# Altium schematic sheet OCSPI.SchDoc: OCSPI
size A4; CompanyName: STMicroelectronics; Organization: Microcontrollers Division; DocumentNumber: 8; SheetNumber: 9; SheetTotal: 19
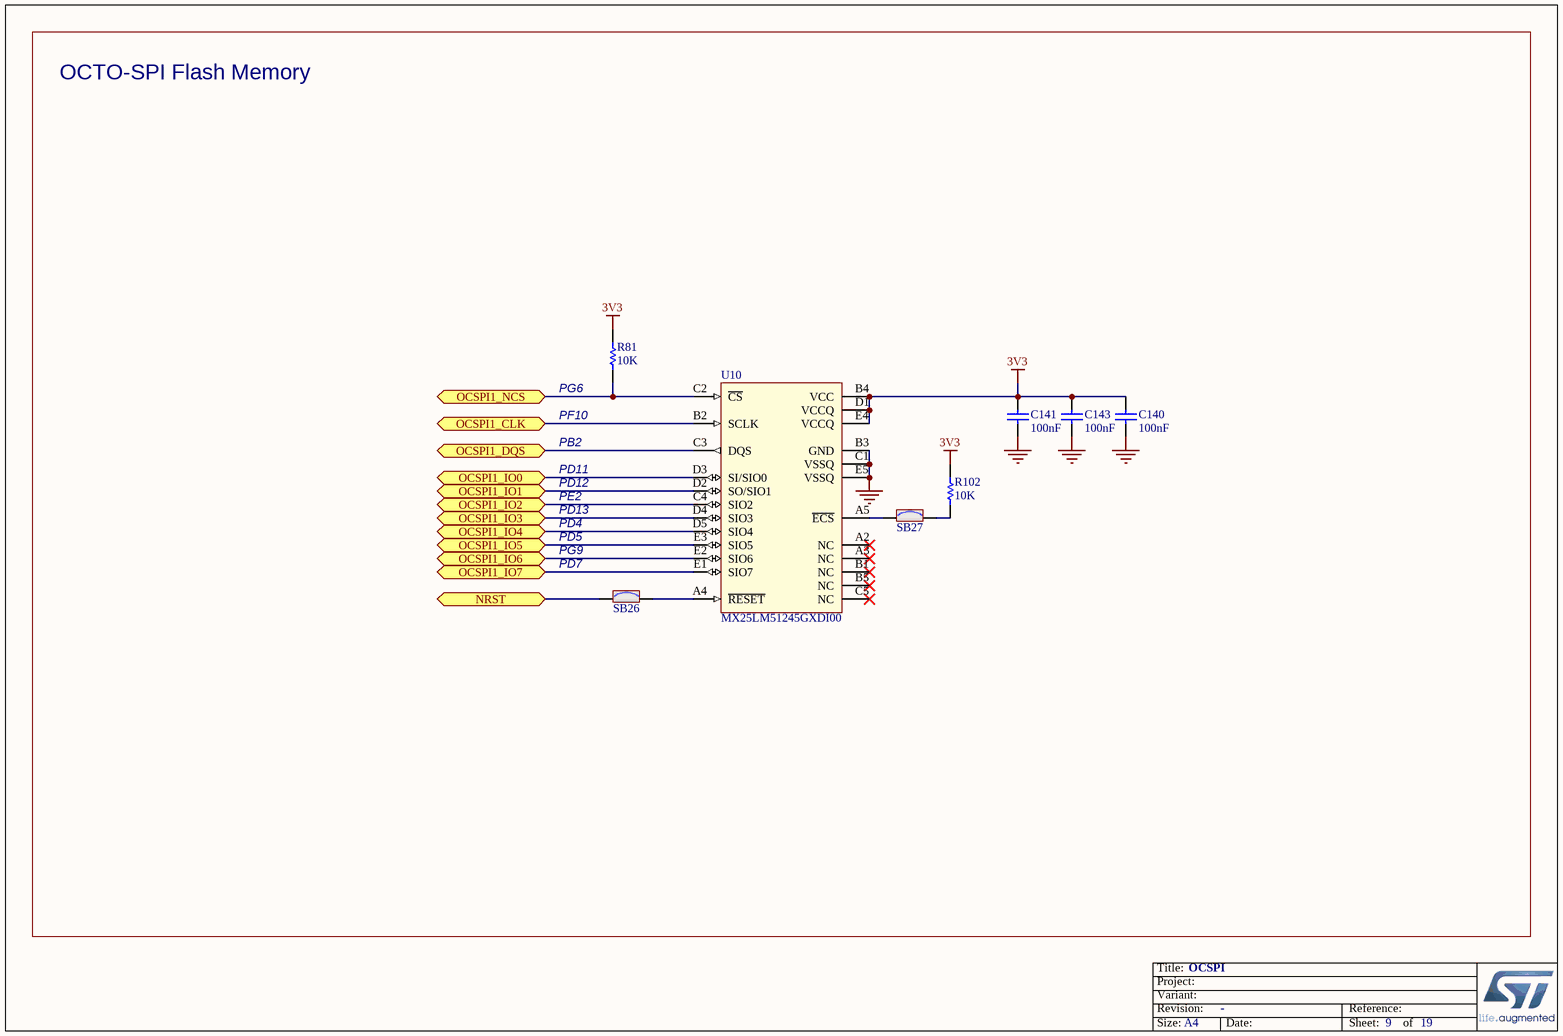
[diagram p0: OCSPI.SchDoc]

## Parts
C140  value 100nF  [C0402]  (hidden comment: Capacitor)
C141  value 100nF  [C0402]  (hidden comment: Capacitor)
C143  value 100nF  [C0402]  (hidden comment: Capacitor)
R81  value 10K  [R0402]  (hidden comment: Resistor)
R102  value 10K  [R0402]  (hidden comment: Resistor)
SB26  SB_ON  [SOLDER-BRIDGE_R0603-0R]  (value not drawn)
SB27  SB_ON  [SOLDER-BRIDGE_R0603-0R]  (value not drawn)
U10  MX25LM51245GXDI00  [ICC_BGA24_5X5-BALL-ARRAY_6X8_P1]

## Ports
NRST, OCSPI1_CLK (bidir), OCSPI1_DQS (bidir), OCSPI1_IO0 (bidir), OCSPI1_IO1 (bidir), OCSPI1_IO2 (bidir), OCSPI1_IO3 (bidir), OCSPI1_IO4 (bidir), OCSPI1_IO5 (bidir), OCSPI1_IO6 (bidir), OCSPI1_IO7 (bidir), OCSPI1_NCS (bidir)

## Nets
3V3: C140.2 C141.2 C143.2 R81.2 R102.2 U10.B4(VCC) U10.D1(VCCQ) U10.E4(VCCQ)
GND: C140.1 C141.1 C143.1 U10.B3(GND) U10.C1(VSSQ) U10.E5(VSSQ)
NRST: SB26.1 ; port NRST
OCSPI1_CLK: U10.B2(SCLK) ; port OCSPI1_CLK
OCSPI1_DQS: U10.C3(DQS) ; port OCSPI1_DQS
OCSPI1_IO0: U10.D3(SI/SIO0) ; port OCSPI1_IO0
OCSPI1_IO1: U10.D2(SO/SIO1) ; port OCSPI1_IO1
OCSPI1_IO2: U10.C4(SIO2) ; port OCSPI1_IO2
OCSPI1_IO3: U10.D4(SIO3) ; port OCSPI1_IO3
OCSPI1_IO4: U10.D5(SIO4) ; port OCSPI1_IO4
OCSPI1_IO5: U10.E3(SIO5) ; port OCSPI1_IO5
OCSPI1_IO6: U10.E2(SIO6) ; port OCSPI1_IO6
OCSPI1_IO7: U10.E1(SIO7) ; port OCSPI1_IO7
OCSPI1_NCS: R81.1 U10.C2(~{CS}) ; port OCSPI1_NCS
NetR102_1: R102.1 SB27.2
NetSB26_2: SB26.2 U10.A4(~{RESET})
NetSB27_1: SB27.1 U10.A5(~{ECS})

Not connected (* = marked no-connect by the designer): U10 A2(NC)* A3(NC)* B1(NC)* B5(NC)* C5(NC)*

## Notes on the sheet
- OCTO-SPI Flash Memory
- (near R81) PG6
- (near R81) PF10
- PB2
- PD11
- PD12
- PE2
- PD13
- PD4
- PD5
- PG9
- (near SB26) PD7
- Title:
- Project:
- Size:
- Revision:
- Variant:
- A4
- -
- Date:
- Reference:
- Sheet:
- of

## Library data of the parts
C140 C141 C143 = MCD-00102: Capacitor, MLCC, 100nF, 16V, X7R, 10%, 0402, T=0,5mm; Manufacturer_Part_Number: CC0402KRX7R7BB104; Manufacturer: YAGEO; Alternate_Manufacturer_Part_Number: GCM155R71C104KA55D; Alternate_Manufacturer: MURATA; ECCN_US: EAR99; ECCN_EU: NEC; Provided_By: SUBCO; Internal_Part_Number: MCD-00102; Status: Released; Part_Type: Capacitor; Package: C0402; ComponentLink1Description: Datasheet; ComponentLink1URL: http://tunmcdsvn.tun.st.com/Component_Datasheet_Library/Trunk/Capacitors/Yageo_Multilayer_Capacitor_X7R_series_100pF_to_22uF
R81 R102 = MCD-00053: Resistor,10K,0402,1%,1/16W; Manufacturer_Part_Number: RC0402FR-0710KL; Manufacturer: YAGEO; ECCN_US: EAR99; ECCN_EU: NEC; Provided_By: SUBCO; Internal_Part_Number: MCD-00053; Status: Released; Part_Type: Resistor; Package: R0402; ComponentLink1Description: Datasheet; ComponentLink1URL: http://tunmcdsvn.tun.st.com/Component_Datasheet_Library/Trunk/Resistors/Yageo_Resistor_RC0402-series
SB26 SB27 = MCD-00071: Solder Bridge ON; Part_Type: Mechanical; Manufacturer_Part_Number: RC0603JR-070RL; Manufacturer: YAGEO; Provided_By: SUBCO; Internal_Part_Number: MCD-00071; Status: Released; Package: SB0603; ComponentLink1Description: Datasheet; ComponentLink1URL: http://tunmcdsvn.tun.st.com/Component_Datasheet_Library/Trunk/Resistors/Yageo_Resistor_RC0603-series; ECCN_US: n/a; ECCN_EU: n/a
U10 = MCD-00246: Memory,Octo-SPI-NOR,512Mb,2048x16,133MHz,3V,DTR,BGA24, CMOS MXSMIO; Part_Type: IC; Manufacturer: MACRONIX; ECCN_US: 3A991.b.1.a; ECCN_EU: NEC; Provided_By: SUBCO; Internal_Part_Number: MCD-00246; Value: MX25LM51245GXDI00; Status: Released; Manufacturer_Part_Number: MX25LM51245GXDI00; Package: BGA24; ComponentLink1Description: Datasheet; ComponentLink1URL: http://tunmcdsvn.tun.st.com/Component_Datasheet_Library/Trunk/IC/Macronix_OctoSPI_NOR_512Mb_MX25LM51245GXDI0A/Macronix_OctoSPI_NOR_512Mb_MX25LM51245G-0.02_Nov22.pdf